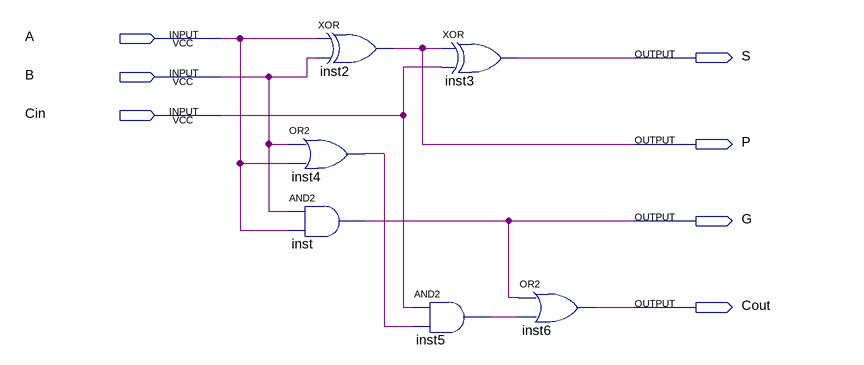
[diagram p0: schematic sheet]
// Quartus schematic CLA_1bit.bdf as structural Verilog: 6 symbols, 7 pins
module CLA_1bit (
  input  A,
  input  B,
  input  Cin,
  output S,
  output P,
  output G,
  output Cout
);

  wire inst4_out, inst5_out;

  xor inst2 (P, A, B);
  or inst4 (inst4_out, B, A);
  and inst (G, B, A);
  and inst5 (inst5_out, Cin, inst4_out);
  xor inst3 (S, P, Cin);
  or inst6 (Cout, G, inst5_out);
endmodule
